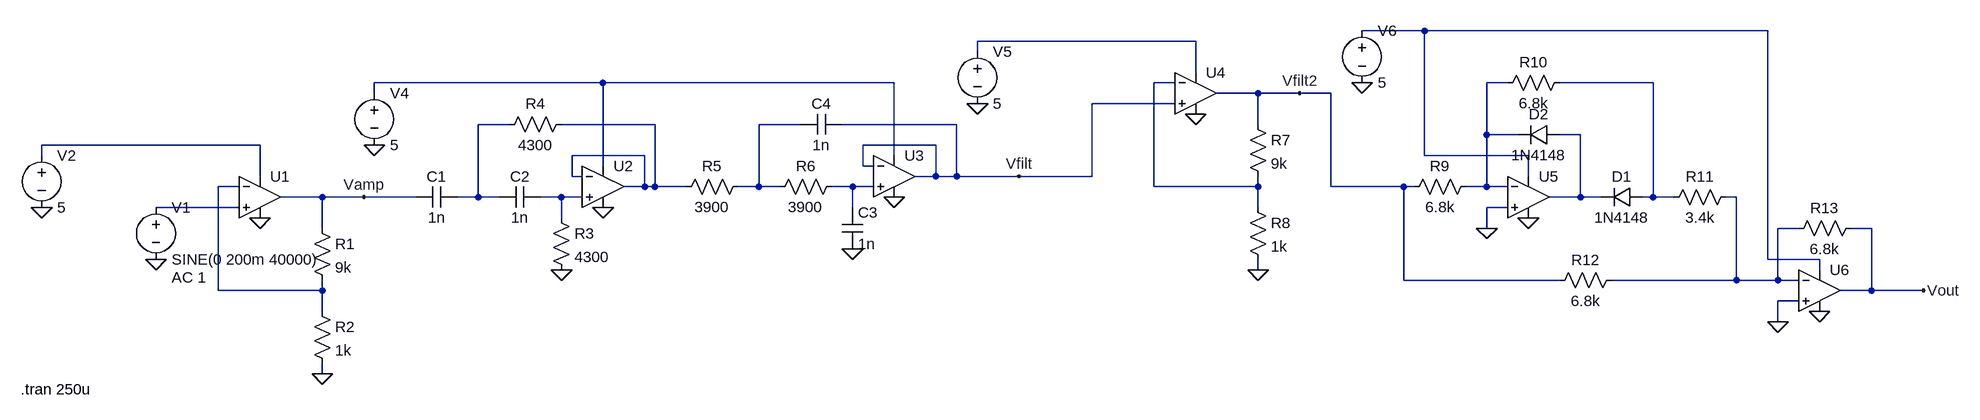
[diagram p0: schematic Ultrasonic Full Circuit v2.asc]
Ultrasonic Full Circuit v2.asc, the LTspice schematic file:
Version 4.1
SHEET 1 2856 680
WIRE 2016 -208 1920 -208
WIRE 2544 -208 2016 -208
WIRE 1664 -192 1328 -192
WIRE 1328 -176 1328 -192
WIRE 1664 -144 1664 -192
WIRE 752 -128 400 -128
WIRE 1200 -128 752 -128
WIRE 1632 -128 1600 -128
WIRE 2144 -128 2112 -128
WIRE 2368 -128 2224 -128
WIRE 400 -112 400 -128
WIRE 1760 -112 1696 -112
WIRE 1824 -112 1760 -112
WIRE 1872 -112 1824 -112
WIRE 1632 -96 1504 -96
WIRE 608 -64 560 -64
WIRE 832 -64 688 -64
WIRE 1056 -64 992 -64
WIRE 1296 -64 1120 -64
WIRE 1760 -64 1760 -112
WIRE 2112 -48 2112 -128
WIRE 2160 -48 2112 -48
WIRE 2256 -48 2224 -48
WIRE 224 -32 -112 -32
WIRE 1264 -32 1152 -32
WIRE -112 -16 -112 -32
WIRE 816 -16 704 -16
WIRE 1200 -16 1200 -128
WIRE 2016 -16 2016 -208
WIRE 2176 -16 2016 -16
WIRE 752 0 752 -128
WIRE 1152 0 1152 -32
WIRE 1168 0 1152 0
WIRE 224 16 224 -32
WIRE 704 16 704 -16
WIRE 720 16 704 16
WIRE 1264 16 1264 -32
WIRE 1264 16 1232 16
WIRE 1296 16 1296 -64
WIRE 1296 16 1264 16
WIRE 1392 16 1296 16
WIRE 1504 16 1504 -96
WIRE 1504 16 1392 16
WIRE 2176 16 2176 -16
WIRE 192 32 160 32
WIRE 816 32 816 -16
WIRE 816 32 784 32
WIRE 832 32 832 -64
WIRE 832 32 816 32
WIRE 880 32 832 32
WIRE 992 32 992 -64
WIRE 992 32 960 32
WIRE 1024 32 992 32
WIRE 1136 32 1104 32
WIRE 1168 32 1136 32
WIRE 1600 32 1600 -128
WIRE 1760 32 1760 16
WIRE 1760 32 1600 32
WIRE 1872 32 1872 -112
WIRE 1984 32 1872 32
WIRE 2000 32 1984 32
WIRE 2112 32 2112 -48
WIRE 2112 32 2080 32
WIRE 2144 32 2112 32
WIRE 320 48 256 48
WIRE 384 48 320 48
WIRE 464 48 384 48
WIRE 560 48 560 -64
WIRE 560 48 528 48
WIRE 592 48 560 48
WIRE 688 48 656 48
WIRE 720 48 688 48
WIRE 2256 48 2256 -48
WIRE 2256 48 2208 48
WIRE 2288 48 2256 48
WIRE 2368 48 2368 -128
WIRE 2368 48 2352 48
WIRE 2400 48 2368 48
WIRE 2496 48 2480 48
WIRE 192 64 64 64
WIRE 1136 64 1136 32
WIRE 1760 64 1760 32
WIRE 2144 64 2112 64
WIRE 688 80 688 48
WIRE 320 96 320 48
WIRE 2112 96 2112 64
WIRE 2592 96 2560 96
WIRE 2704 96 2672 96
WIRE 2544 144 2544 -208
WIRE 2624 144 2544 144
WIRE 1760 160 1760 144
WIRE 2624 160 2624 144
WIRE 1984 176 1984 32
WIRE 2224 176 1984 176
WIRE 2496 176 2496 48
WIRE 2496 176 2304 176
WIRE 2560 176 2560 96
WIRE 2560 176 2496 176
WIRE 2592 176 2560 176
WIRE 160 192 160 32
WIRE 320 192 320 176
WIRE 320 192 160 192
WIRE 2704 192 2704 96
WIRE 2704 192 2656 192
WIRE 2784 192 2704 192
WIRE 2592 208 2560 208
WIRE 320 224 320 192
WIRE 2560 240 2560 208
WIRE 320 320 320 304
FLAG 320 320 0
FLAG 384 48 Vamp
FLAG 64 144 0
FLAG -112 64 0
FLAG 224 80 0
FLAG 688 160 0
FLAG 752 64 0
FLAG 400 -32 0
FLAG 1136 128 0
FLAG 1200 48 0
FLAG 1760 160 0
FLAG 1824 -112 Vfilt2
FLAG 1328 -96 0
FLAG 1664 -80 0
FLAG 2112 96 0
FLAG 2176 80 0
FLAG 2560 240 0
FLAG 2624 224 0
FLAG 2784 192 Vout
FLAG 1920 -128 0
FLAG 1392 16 Vfilt
SYMBOL res 304 80 R0
SYMATTR InstName R1
SYMATTR Value 9k
SYMBOL res 304 208 R0
SYMATTR InstName R2
SYMATTR Value 1k
SYMBOL voltage 64 48 R0
WINDOW 123 24 124 Left 2
WINDOW 39 0 0 Left 0
SYMATTR Value2 AC 1
SYMATTR InstName V1
SYMATTR Value SINE(0 200m 40000)
SYMBOL voltage -112 -32 R0
SYMATTR InstName V2
SYMATTR Value 5
SYMBOL OpAmps\\UniversalOpAmp 224 48 R0
SYMATTR InstName U1
SYMBOL cap 528 32 R90
WINDOW 0 0 32 VBottom 2
WINDOW 3 32 32 VTop 2
SYMATTR InstName C1
SYMATTR Value 1n
SYMBOL cap 656 32 R90
WINDOW 0 0 32 VBottom 2
WINDOW 3 32 32 VTop 2
SYMATTR InstName C2
SYMATTR Value 1n
SYMBOL OpAmps\\UniversalOpAmp 752 32 R0
SYMATTR InstName U2
SYMBOL res 672 64 R0
SYMATTR InstName R3
SYMATTR Value 4300
SYMBOL res 704 -80 R90
WINDOW 0 0 56 VBottom 2
WINDOW 3 32 56 VTop 2
SYMATTR InstName R4
SYMATTR Value 4300
SYMBOL voltage 400 -128 R0
SYMATTR InstName V4
SYMATTR Value 5
SYMBOL res 976 16 R90
WINDOW 0 0 56 VBottom 2
WINDOW 3 32 56 VTop 2
SYMATTR InstName R5
SYMATTR Value 3900
SYMBOL res 1120 16 R90
WINDOW 0 0 56 VBottom 2
WINDOW 3 32 56 VTop 2
SYMATTR InstName R6
SYMATTR Value 3900
SYMBOL OpAmps\\UniversalOpAmp 1200 16 R0
SYMATTR InstName U3
SYMBOL cap 1120 64 R0
SYMATTR InstName C3
SYMATTR Value 1n
SYMBOL cap 1120 -80 R90
WINDOW 0 0 32 VBottom 2
WINDOW 3 32 32 VTop 2
SYMATTR InstName C4
SYMATTR Value 1n
SYMBOL res 1744 -80 R0
SYMATTR InstName R7
SYMATTR Value 9k
SYMBOL res 1744 48 R0
SYMATTR InstName R8
SYMATTR Value 1k
SYMBOL voltage 1328 -192 R0
SYMATTR InstName V5
SYMATTR Value 5
SYMBOL OpAmps\\UniversalOpAmp 1664 -112 R0
SYMATTR InstName U4
SYMBOL res 2096 16 R90
WINDOW 0 0 56 VBottom 2
WINDOW 3 32 56 VTop 2
SYMATTR InstName R9
SYMATTR Value 6.8k
SYMBOL OpAmps\\UniversalOpAmp 2176 48 R0
SYMATTR InstName U5
SYMBOL diode 2352 32 R90
WINDOW 0 0 32 VBottom 2
WINDOW 3 32 32 VTop 2
SYMATTR InstName D1
SYMATTR Value 1N4148
SYMBOL diode 2224 -64 R90
WINDOW 0 0 32 VBottom 2
WINDOW 3 32 32 VTop 2
SYMATTR InstName D2
SYMATTR Value 1N4148
SYMBOL res 2240 -144 R90
WINDOW 0 0 56 VBottom 2
WINDOW 3 32 56 VTop 2
SYMATTR InstName R10
SYMATTR Value 6.8k
SYMBOL res 2496 32 R90
WINDOW 0 0 56 VBottom 2
WINDOW 3 32 56 VTop 2
SYMATTR InstName R11
SYMATTR Value 3.4k
SYMBOL OpAmps\\UniversalOpAmp 2624 192 R0
SYMATTR InstName U6
SYMBOL res 2320 160 R90
WINDOW 0 0 56 VBottom 2
WINDOW 3 32 56 VTop 2
SYMATTR InstName R12
SYMATTR Value 6.8k
SYMBOL res 2688 80 R90
WINDOW 0 0 56 VBottom 2
WINDOW 3 32 56 VTop 2
SYMATTR InstName R13
SYMATTR Value 6.8k
SYMBOL voltage 1920 -224 R0
SYMATTR InstName V6
SYMATTR Value 5
TEXT -144 344 Left 2 !.tran 250u

The netlist it stands for:
* Ultrasonic Full Circuit v2.asc
R1 Vamp N012 9k
R2 N012 0 1k
V1 N016 0 SINE(0 200m 40000) AC 1
V2 N011 0 5
X§U1 N016 N012 N011 0 Vamp level1 Avol=1Meg GBW=10Meg Vos=0 En=0 Enk=0 In=0 Ink=0 Rin=500Meg  ; pins In+ In- V+ V- OUT
C1 N007 Vamp 1n
C2 N014 N007 1n
X§U2 N014 N008 N003 0 N008 level1 Avol=1Meg GBW=10Meg Vos=0 En=0 Enk=0 In=0 Ink=0 Rin=500Meg  ; pins In+ In- V+ V- OUT
R3 N014 0 4300
R4 N008 N007 4300
V4 N003 0 5
R5 N009 N008 3900
R6 N013 N009 3900
X§U3 N013 Vfilt N003 0 Vfilt level1 Avol=1Meg GBW=10Meg Vos=0 En=0 Enk=0 In=0 Ink=0 Rin=500Meg  ; pins In+ In- V+ V- OUT
C3 N013 0 1n
C4 Vfilt N009 1n
R7 Vfilt2 N004 9k
R8 N004 0 1k
V5 N002 0 5
X§U4 Vfilt N004 N002 0 Vfilt2 level1 Avol=1Meg GBW=10Meg Vos=0 En=0 Enk=0 In=0 Ink=0 Rin=500Meg  ; pins In+ In- V+ V- OUT
R9 N005 Vfilt2 6.8k
X§U5 0 N005 N001 0 N010 level1 Avol=1Meg GBW=10Meg Vos=0 En=0 Enk=0 In=0 Ink=0 Rin=500Meg  ; pins In+ In- V+ V- OUT
D1 N006 N010 1N4148
D2 N010 N005 1N4148
R10 N006 N005 6.8k
R11 N015 N006 3.4k
X§U6 0 N015 N001 0 Vout level1 Avol=1Meg GBW=10Meg Vos=0 En=0 Enk=0 In=0 Ink=0 Rin=500Meg  ; pins In+ In- V+ V- OUT
R12 N015 Vfilt2 6.8k
R13 Vout N015 6.8k
V6 N001 0 5
.model D D
.lib standard.dio
.tran 250u
.lib UniversalOpAmp1.lib
.backanno
.end